# Altium project Keyfinder.PrjPcb
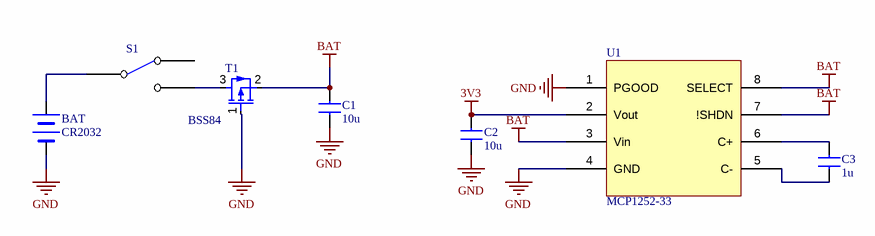
[diagram p0: Keyfinder_Power.SchDoc]
3 sheets, 24 parts. Net scope: global (net labels, ports and power ports of the same name join across sheets).
Board file: Keyfinder.PcbDoc
Sheets:
  Keyfinder_Power.SchDoc
  Keyfinder_RF.SchDoc
  Keyfinder_Alert.SchDoc

## Sheet Keyfinder_Power.SchDoc: Keyfinder Power
size A4; DrawnBy: M. Schwegler; Organization: HSLU T&A; Address1: Abteilung Elektrotechnik; Address2: Technikumsstrasse 21; Address3: CH-6048 Horw; Revision: v1; SheetNumber: 1; SheetTotal: 4; Projektname: SmartBoard; DocumentName: Keyfinder Power

### Parts
BAT  CR2032  [Bat_case]
C1  10u  [0805_C]
C2  10u  [0805_C]
C3  1u  [0805_C]
S1  SW SPDT  [SW_MCLSS22]  (value not drawn)
T1  BSS84  [SOT23-3]
U1  MCP1252-33  [MSOP8]

### Nets
3V3: C2.2 U1.2(Vout)
BAT: C1.2 T1.2(S) U1.3(Vin) U1.7(!SHDN) U1.8(SELECT)
GND: BAT.2 C1.1 C2.1 T1.1(G) U1.1(PGOOD) U1.4(GND)
NetBAT_1: BAT.1 S1.2(COMMON)
NetC3_1: C3.1 U1.5(C-)
NetC3_2: C3.2 U1.6(C+)
NetS1_3: S1.3(NO) T1.3(D)

Not connected (* = marked no-connect by the designer): S1 1(NC)

### Notes on the sheet
- Project:
- Drawn by:
- Size:
- Sheet
- A4
- Rev.:
- of
- Date:
- File:

### Library data of the parts
BAT = BATTERY
C1-C3 = C?: Normaler Kondensator
T1 = MOSFET-P 1G,2D,3S (Diode)
U1 = VOLTREG

## Sheet Keyfinder_RF.SchDoc: Keyfinder nRF24L01+
size A4; DrawnBy: M. Schwegler; Organization: HSLU T&A; Address1: Abteilung Elektrotechnik; Address2: Technikumsstrasse 21; Address3: CH-6048 Horw; Revision: v1; SheetNumber: 3; SheetTotal: 4; Projektname: SmartBoard
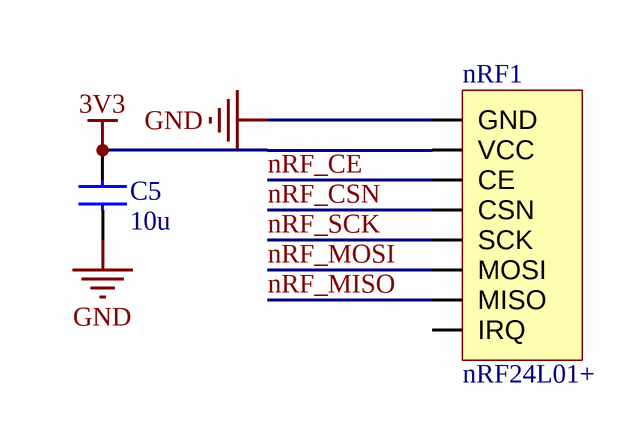
[diagram p1: Keyfinder_RF.SchDoc]

### Parts
C5  10u  [0805_C]
nRF1  nRF24L01+  [CON_THT_2x4P_RM2.54_Stiftl]

### Nets
3V3: C5.2 nRF1.2(VCC)
GND: C5.1 nRF1.1(GND)
nRF_CE: nRF1.3(CE)
nRF_CSN: nRF1.4(CSN)
nRF_MISO: nRF1.7(MISO)
nRF_MOSI: nRF1.6(MOSI)
nRF_SCK: nRF1.5(SCK)

Not connected (* = marked no-connect by the designer): nRF1 8(IRQ)

### Notes on the sheet
- Project:
- Drawn by:
- Size:
- Sheet
- A4
- Rev.:
- of
- Date:
- File:

### Library data of the parts
C5 = C?: Normaler Kondensator
nRF1 = Bluefruit

## Sheet Keyfinder_Alert.SchDoc: Keyfinder Alert
size A4; DrawnBy: M. Schwegler; Organization: HSLU T&A; Address1: Abteilung Elektrotechnik; Address2: Technikumsstrasse 21; Address3: CH-6048 Horw; Revision: v1; SheetNumber: 4; SheetTotal: 4; Projektname: SmartBoard; DocumentName: Keyfinder; ProjectName: SmartBoard
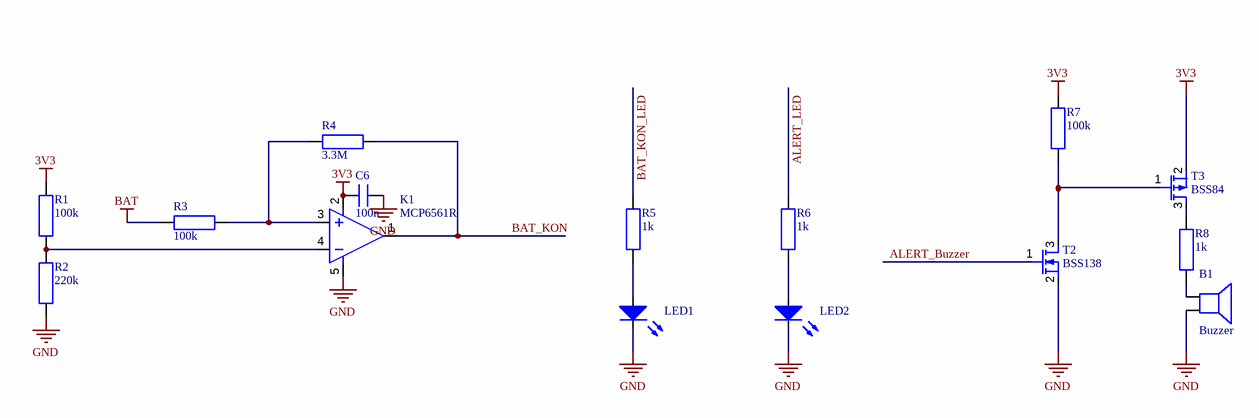
[diagram p2: Keyfinder_Alert.SchDoc]

### Parts
B1  Buzzer  [piezo_ele]
C6  100n  [0805_C]
K1  MCP6561R  [SOT23-5]
LED1  (no value)  [0805_LED]
LED2  (no value)  [0805_LED]
R1  100k  [0805_R]
R2  220k  [0805_R]
R3  100k  [0805_R]
R4  3.3M  [0805_R]
R5  1k  [0805_R]
R6  1k  [0805_R]
R7  100k  [0805_R]
R8  1k  [0805_R]
T2  BSS138  [SOT23-3]
T3  BSS84  [SOT23-3]

### Nets
3V3: C6.2 K1.2 R1.1 R7.1 T3.2(S)
BAT: R3.2
GND: B1.2 C6.1 K1.5 LED1.2(K) LED2.2(K) R2.2 T2.2(S)
ALERT_Buzzer: T2.1(G)
ALERT_LED: R6.1
BAT_KON: K1.1 R4.1
BAT_KON_LED: R5.1
NetB1_1: B1.1 R8.2
NetK1_3: K1.3 R3.1 R4.2
NetK1_4: K1.4 R1.2 R2.1
NetLED1_1: LED1.1(A) R5.2
NetLED2_1: LED2.1(A) R6.2
NetR7_2: R7.2 T2.3(D) T3.1(G)
NetR8_1: R8.1 T3.3(D)

### Notes on the sheet
- Project:
- Drawn by:
- Size:
- Sheet
- A4
- Rev.:
- of
- Date:
- File:

### Library data of the parts
B1 = SPEAKER
C6 = C?: Normaler Kondensator
K1 = OPAMP
LED1 LED2 = LED
R1-R8 = R?: Normaler Widerstand
T2 = MOSFET-N 1D,2G,3S: Remark: *
T3 = MOSFET-P 1D,2G,3S

## Nets that join several sheets
3V3: Keyfinder_Power (C2.2 U1.2), Keyfinder_RF (C5.2 nRF1.2), Keyfinder_Alert (5 pins)
BAT: Keyfinder_Power (5 pins), Keyfinder_Alert (R3.2)
GND: Keyfinder_Power (6 pins), Keyfinder_RF (C5.1 nRF1.1), Keyfinder_Alert (7 pins)